# EAGLE schematic Keurig (EAGLE 7.7.0)
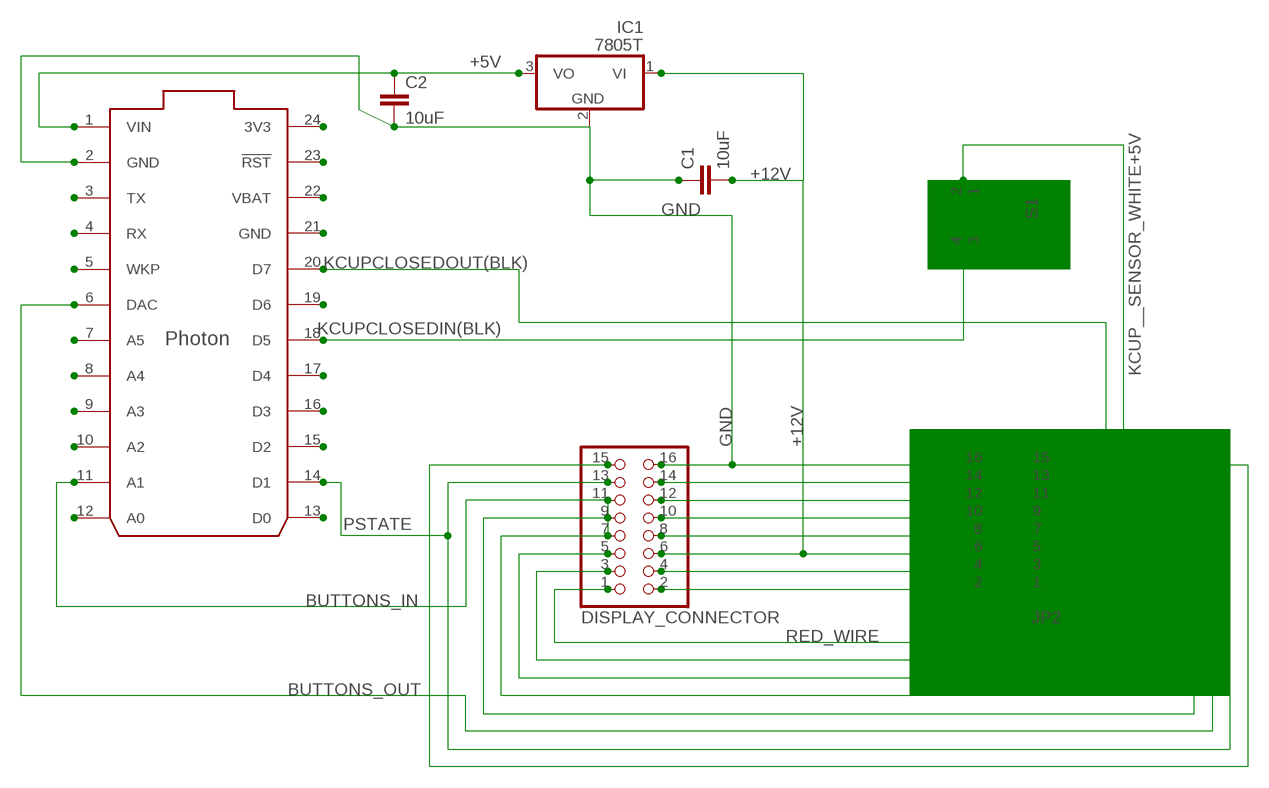
[diagram p0: schematic, sheet 1]

## Parts
C1  10uF  C-EU025-025X050  [C025-025X050]
C2  10uF  C-EU025-025X050  [C025-025X050]
DISPLAY_CONNECTOR  PINHD-2X8  [2X08]
IC1  7805T  [TO220H]
JP2  PINHD-2X8  [2X08]
S1  TAC_SWITCHSMD  [TACTILE_SWITCH_SMD]
U$1  PHOTON_SMD  [PHOTON_SMD]

## Nets
+5V: C2.1 IC1.3(VO) U$1.1(VIN)
+12V: C1.2 DISPLAY_CONNECTOR.6 IC1.1(VI) JP2.6
BUTTONS_IN: DISPLAY_CONNECTOR.7 JP2.7 JP2.9 U$1.11(A1)
BUTTONS_OUT: JP2.11 U$1.6(DAC)
GND: C1.1 C2.2 DISPLAY_CONNECTOR.16 IC1.2(GND) JP2.16 U$1.2(GND)
KCUP__SENSOR_WHITE+5V: S1.2
KCUPCLOSEDIN(BLK): S1.4 U$1.18(D5)
KCUPCLOSEDOUT(BLK): U$1.20(D7)
N$3: DISPLAY_CONNECTOR.3 JP2.3
N$5: DISPLAY_CONNECTOR.11
N$6: DISPLAY_CONNECTOR.9
N$7: DISPLAY_CONNECTOR.5 JP2.5
N$11: U$1.3(TX)
N$12: U$1.4(RX)
N$13: U$1.5(WKP)
N$15: U$1.7(A5)
N$16: DISPLAY_CONNECTOR.15 JP2.15
N$17: U$1.8(A4)
N$18: U$1.9(A3)
N$19: DISPLAY_CONNECTOR.2 JP2.2
N$20: DISPLAY_CONNECTOR.4 JP2.4
N$21: U$1.10(A2)
N$22: DISPLAY_CONNECTOR.8 JP2.8
N$23: DISPLAY_CONNECTOR.10 JP2.10
N$24: DISPLAY_CONNECTOR.12 JP2.12
N$25: DISPLAY_CONNECTOR.14 JP2.14
N$27: U$1.12(A0)
N$28: U$1.13(D0)
N$30: U$1.15(D2)
N$31: U$1.16(D3)
N$32: U$1.17(D4)
N$34: U$1.19(D6)
N$36: U$1.21(GND)
N$37: U$1.22(VBAT)
N$38: U$1.23(!RST)
N$39: U$1.24(3V3)
PSTATE: DISPLAY_CONNECTOR.13 JP2.13 U$1.14(D1)
RED_WIRE: DISPLAY_CONNECTOR.1 JP2.1
Unconnected: S1.1 S1.3 U$1.25(EN) U$1.26(!SETUP) U$1.27(RGB_RED) U$1.28(RGB_GREEN) U$1.29(RGB_BLUE) U$1.30(USB_D-) U$1.31(USB_D+)

## Library data of the parts
C1 C2 = rcl:C-EU: CAPACITOR, European symbol
DISPLAY_CONNECTOR JP2 = pinhead:PINHD-2X8: PIN HEADER
IC1 = linear:78*: Positive VOLTAGE REGULATOR Source: http://cache.national.com/ds/LM/LM78L05.pdf http://www.fairchildsemi.com/ds/LM/LM7805.pdf
S1 = Spark:TAC_SWITCH: SMD Tactiile Switch
U$1 = Spark:PHOTON_SMD: Photon (without headers) - designed to be surface mounted with 7 extra exposed pads on the bottom of the board which include, 3 RGB LED outputs, /SETUP, EN (3.3V SMPS enable input), USB D+ and USB D-.

## Module TEST
Ports: 

### Library data of the parts